# Altium schematic sheet EM78M611RX.SchDoc
size A4
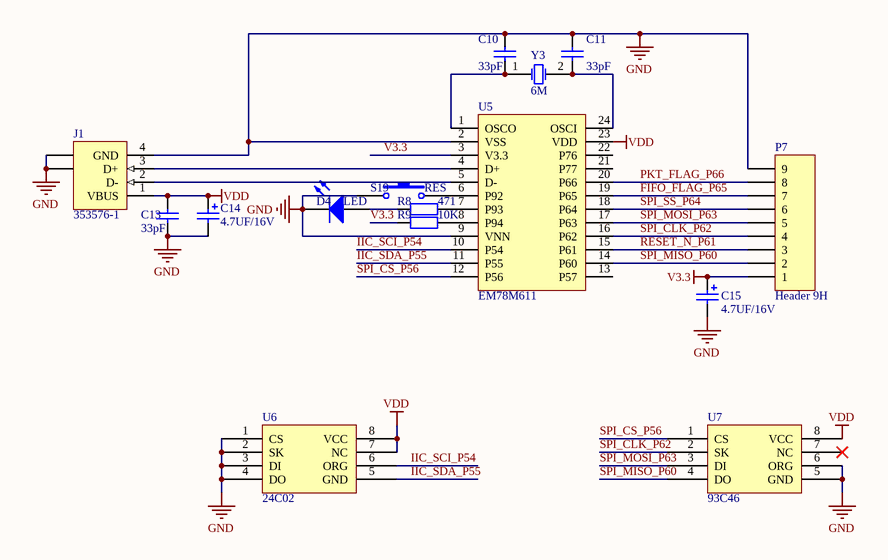
[diagram p0: EM78M611RX.SchDoc]

## Parts
C10  value 33pF  [c0805]  (hidden comment: Cap)
C11  value 33pF  [c0805]  (hidden comment: Cap)
C13  value 33pF  [c0805]  (hidden comment: Cap)
C14  value 4.7UF/16V  [C1206-2]  (hidden comment: Cap Pol1)
C15  value 4.7UF/16V  [RB5]  (hidden comment: Cap Pol1)
D4  LED  [led-3]
J1  353576-1  [USBSD]
P7  Header 9H  [rfm]
R8  value 471  [R0805]  (hidden comment: Res2)
R9  value 10K  [R0805]  (hidden comment: Res2)
S19  RES  [SW-PB]
U5  EM78M611  [DIP24]
U6  24C02  [sop8]
U7  93C46  [sop8]
Y3  6M  [CRY]

## Nets
GND: C10.1 C11.2 C13.1 C14.2 C15.2 D4.2(K) J1.4(GND) J1.5(SHLD) J1.6(SHLD) P7.9 S19.1 U5.2(VSS) U5.9(VNN) U6.1(CS) U6.2(SK) U6.3(DI) U6.4(DO) U7.5(GND) U7.6(ORG)
V3.3: C15.1 P7.1 R9.1 U5.3(V3.3)
VDD: C13.2 C14.1 J1.1(VBUS) U5.23(VDD) U6.7(NC) U6.8(VCC) U7.8(VCC)
FIFO_FLAG_P65: P7.7 U5.19(P65)
IIC_SCI_P54: U5.10(P54) U6.6(ORG)
IIC_SDA_P55: U5.11(P55) U6.5(GND)
PKT_FLAG_P66: P7.8 U5.20(P66)
RESET_N_P61: P7.3 U5.15(P61)
SPI_CLK_P62: P7.4 U5.16(P62) U7.2(SK)
SPI_CS_P56: U5.12(P56) U7.1(CS)
SPI_MISO_P60: P7.2 U5.14(P60) U7.4(DO)
SPI_MOSI_P63: P7.5 U5.17(P63) U7.3(DI)
SPI_SS_P64: P7.6 U5.18(P64)
NetC10_2: C10.2 U5.1(OSCO) Y3.1(OSC1)
NetC11_1: C11.1 U5.24(OSCI) Y3.2(OSC2)
NetD4_1: D4.1(A) R8.1
NetJ1_2: J1.2(D-) U5.5(D-)
NetJ1_3: J1.3(D+) U5.4(D+)
NetR8_2: R8.2 U5.7(P93)
NetR9_2: R9.2 U5.8(P94)
NetS19_2: S19.2 U5.6(P92)

Not connected (* = marked no-connect by the designer): U5 13(P57) 21(P77) 22(P76); U7 7(NC)*

## Library data of the parts
C10 C11 C13 = Cap: Capacitor; Published: 8-Jun-2000; LatestRevisionDate: 17-Jul-2002; LatestRevisionNote: Re-released for DXP Platform.; PackageReference: RAD-0.3; Publisher: Altium Limited
C14 C15 = Cap Pol1: Polarized Capacitor (Radial); Published: 8-Jun-2000; LatestRevisionDate: 17-Jul-2002; LatestRevisionNote: Re-released for DXP Platform.; PackageReference: RB7.6-15; Publisher: Altium Limited
D4 = LED0: Typical INFRARED GaAs LED; Published: 8-Jun-2000; LatestRevisionDate: 08-Jul-2005; LatestRevisionNote: Mech Layer 1 removed.; PackageReference: LED-0; Publisher: Altium Limited
J1 = 353576-1: USB 1.1, Right Angle, SMT, A Type, Receptacle, 4 Position, White; ContactMaterial: Copper Alloy; ContactPlating: Gold over Palladium Nickel; PCB_Layout: Complies with manufacturer's recommendation.; DrillSize: Corresponds to nominal value.; PanelGround: Without; Published: 15-Jul-2004; DatasheetDocument: 11-Apr-2003; PackageDocument: 11-Apr-2003; PackageReference: 353576; Publisher: Altium Limited; HousingMaterial: Thermoplastic; ComponentLink1Description: Manufacturer Link; ComponentLink1URL: http://www.tycoelectronics.com/; ComponentLink2Description: Packaging Specification; ComponentLink2URL: http://ecommas.tycoelectronics.com/commerce/DocumentDelivery/DDEController?Action=showdoc&DocId=Customer+Drawing%7F353576%7FD%7Ftif%7FJapanese%7FJPN_CD_353576_D.tif
P7 = Header 9H: Header, 9-Pin, Right Angle; LatestRevisionDate: 17-Jul-2002; LatestRevisionNote: Re-released for DXP Platform.; Publisher: Altium Limited
R8 R9 = Res2: Resistor; Published: 8-Jun-2000; LatestRevisionDate: 17-Jul-2002; LatestRevisionNote: Re-released for DXP Platform.; PackageReference: AXIAL-0.4; Publisher: Altium Limited
S19 = SW-PB: Switch; Published: 24-Mar-1999; LatestRevisionDate: 17-Jul-2002; LatestRevisionNote: Re-released for DXP Platform.; PackageReference: SPST-2; Publisher: Altium Limited
U5 = EM78M611-24
Y3 = XTAL: Crystal Oscillator; Published: 8-Jun-2000; LatestRevisionDate: 17-Jul-2002; LatestRevisionNote: Re-released for DXP Platform.; PackageReference: R38; Publisher: Altium Limited